# Altium schematic sheet 800U R3N3_SONSER_V1.0.SchDoc
size A4
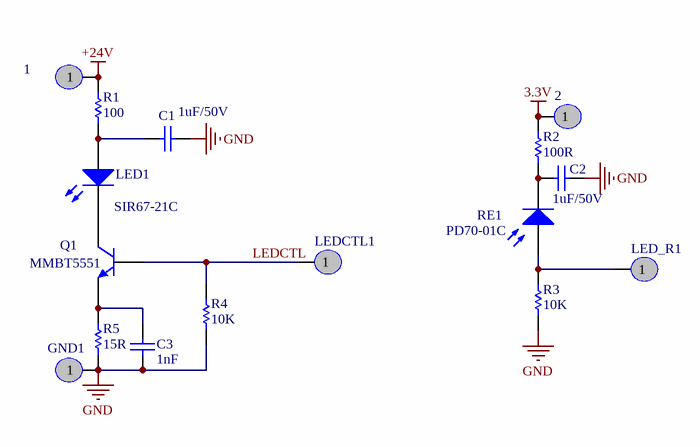
[diagram p0: 800U R3N3_SONSER_V1.0.SchDoc]

## Parts
1  (no value)  [HOLE_SMD]
2  (no value)  [HOLE_SMD]
C1  value 1uF/50V  [C0805]  (hidden comment: 105)
C2  value 1uF/50V  [C0603]  (hidden comment: 105)
C3  value 1nF  [C0603]  (hidden comment: 102)
GND1  (no value)  [HOLE_SMD]
LED1  SIR67-21C  [LED-3.5X2.8]
LED_R1  (no value)  [HOLE_SMD]
LEDCTL1  (no value)  [HOLE_SMD]
Q1  MMBT5551  [SOT-23]
R1  100  [R0805]
R2  value 100R  [R0603]  (hidden comment: 100)
R3  10K  [R0603]
R4  10K  [R0603]
R5  value 15R  [R0805]  (hidden comment: 15)
RE1  PD70-01C  [LED9*4]

## Nets
3.3V: 2.1 R2.2
+24V: 1.1 R1.2
GND: C1.2 C2.2 C3.2 GND1.1 R3.1 R4.1 R5.1
LEDCTL: LEDCTL1.1 Q1.1(B) R4.2
NetC1_1: C1.1 LED1.1(A) R1.1
NetC2_1: C2.1 R2.1 RE1.2(K)
NetC3_1: C3.1 Q1.2(E) R5.2
NetLED1_2: LED1.2(K) Q1.3(C)
NetLED_R1_1: LED_R1.1 R3.2 RE1.1(A)

## Library data of the parts
1 2 GND1 LED_R1 LEDCTL1 = 焊盘
C1-C3 = Cap: 贴片电容; Published: 8-Jun-2000; LatestRevisionDate: 17-Jul-2002; LatestRevisionNote: Re-released for DXP Platform.; PackageReference: RAD-0.3; Publisher: Altium Limited
LED1 = LED0: 贴片红外发射管; Published: 8-Jun-2000; LatestRevisionDate: 08-Jul-2005; LatestRevisionNote: Mech Layer 1 removed.; PackageReference: LED-0; Publisher: Altium Limited; Value: SIR67-21C
Q1 = NPN: 贴片NPN三极管; Value: MMBT5551
R1-R5 = Res Semi: 贴片电阻
  R1: Value: 100
  R3 R4: Value: 10K
RE1 = Photo Sen: 贴片接收管; Published: 24-Mar-1999; LatestRevisionDate: 17-Jul-2002; LatestRevisionNote: Re-released for DXP Platform.; PackageReference: PIN2; Publisher: Altium Limited; Value: PD70-01C